# Altium schematic sheet Ultra-Mega-PS-DAC-V1.00.SchDoc: Ultra-Mega-PowerSupply
size A4; Author: Felipe Navarro; SheetNumber: 4; SheetTotal: 5
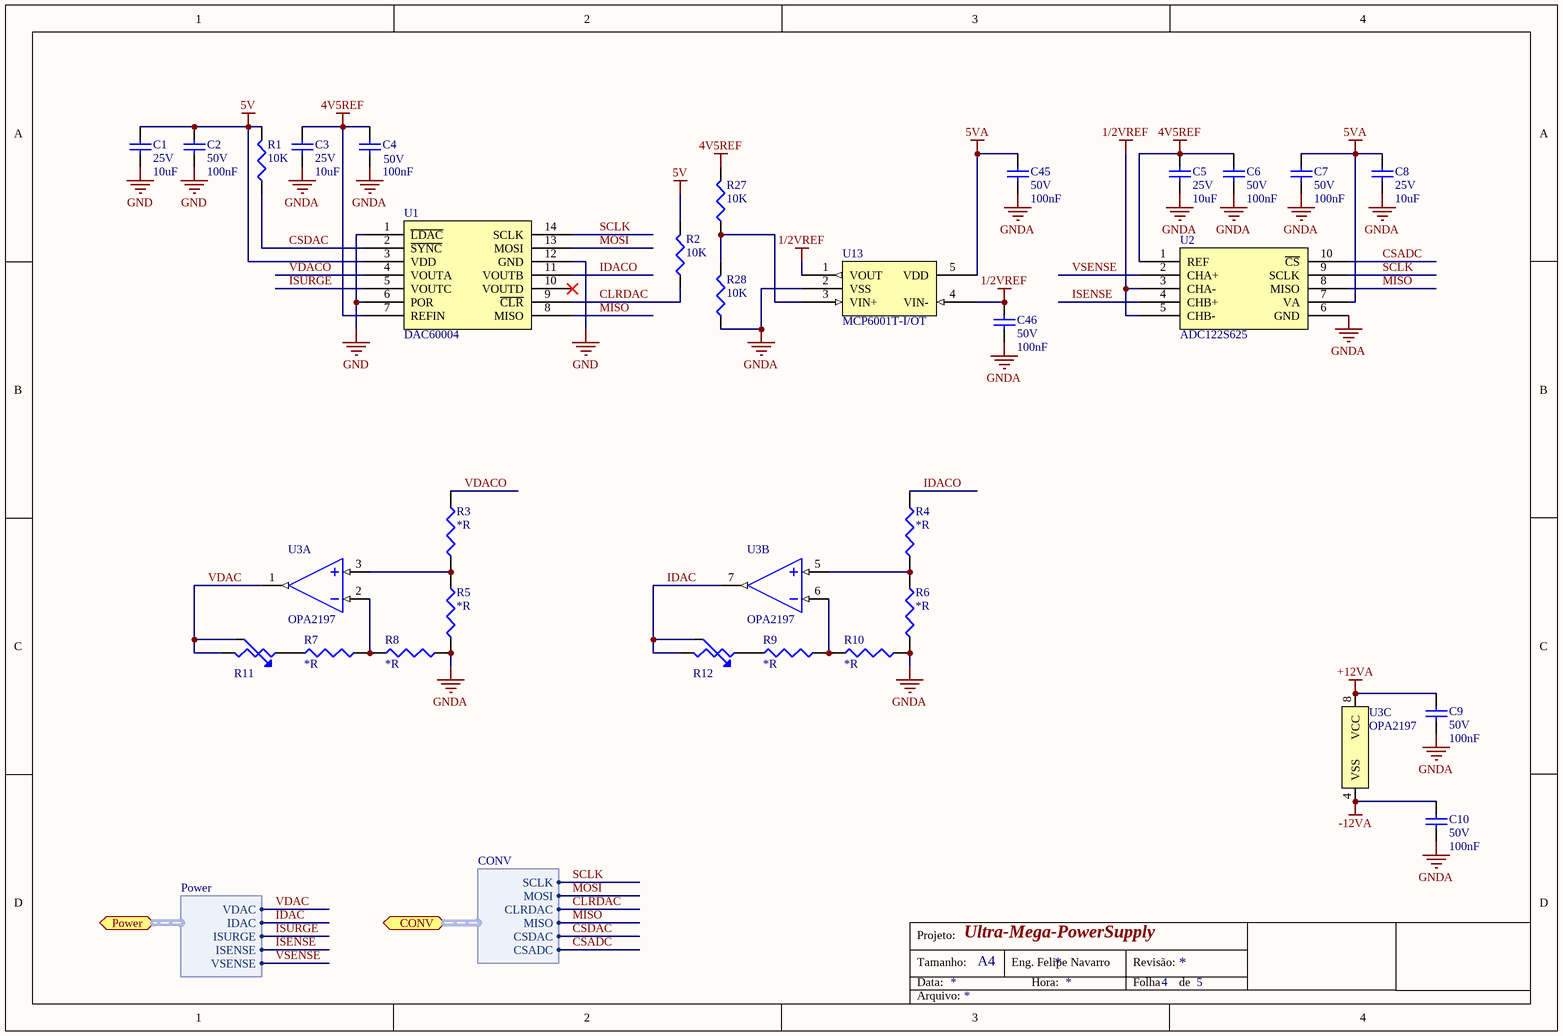
[diagram p0: Ultra-Mega-PS-DAC-V1.00.SchDoc]

## Parts
C1  value 10uF  Tensão: 25V  [CC0805]  (hidden comment: Capacitor Cerâmico)
C2  value 100nF  Tensão: 50V  [CC0603]  (hidden comment: Capacitor Cerâmico)
C3  value 10uF  Tensão: 25V  [CC0805]  (hidden comment: Capacitor Cerâmico)
C4  value 100nF  Tensão: 50V  [CC0603]  (hidden comment: Capacitor Cerâmico)
C5  value 10uF  Tensão: 25V  [CC0805]  (hidden comment: Capacitor Cerâmico)
C6  value 100nF  Tensão: 50V  [CC0603]  (hidden comment: Capacitor Cerâmico)
C7  value 100nF  Tensão: 50V  [CC0603]  (hidden comment: Capacitor Cerâmico)
C8  value 10uF  Tensão: 25V  [CC0805]  (hidden comment: Capacitor Cerâmico)
C9  value 100nF  Tensão: 50V  [CC0603]  (hidden comment: Capacitor Cerâmico)
C10  value 100nF  Tensão: 50V  [CC0603]  (hidden comment: Capacitor Cerâmico)
C45  value 100nF  Tensão: 50V  [CC0603]  (hidden comment: Capacitor Cerâmico)
C46  value 100nF  Tensão: 50V  [CC0603]  (hidden comment: Capacitor Cerâmico)
R1  value 10K  [CC0603]  (hidden comment: Resistor)
R2  value 10K  [CC0603]  (hidden comment: Resistor)
R3  value *R  [CC0603]  (hidden comment: Resistor)
R4  value *R  [CC0603]  (hidden comment: Resistor)
R5  value *R  [CC0603]  (hidden comment: Resistor)
R6  value *R  [CC0603]  (hidden comment: Resistor)
R7  value *R  [CC0603]  (hidden comment: Resistor)
R8  value *R  [CC0603]  (hidden comment: Resistor)
R9  value *R  [CC0603]  (hidden comment: Resistor)
R10  value *R  [CC0603]  (hidden comment: Resistor)
R11  Potenciômetro  [POT]  (value not drawn)
R12  Potenciômetro  [POT]  (value not drawn)
R27  value 10K  [CC0603]  (hidden comment: Resistor)
R28  value 10K  [CC0603]  (hidden comment: Resistor)
U1  DAC60004  [TSSOP-14N]
U2  ADC122S625  [MSOP10]
U3  OPA2197  [SOIC-8N]  (parts A,B,C of 3)
U13  MCP6001T-I/OT  [SOT-23-5N]

## Ports
CONV (harness CONV), Power (harness Power)

## Harnesses
Power: VDAC, IDAC, ISENSE, VSENSE, ISURGE
CONV: SCLK, MOSI, CLRDAC, MISO, CSDAC, CSADC

## Nets
1/2VREF: C46.2 U2.3(CHA-) U2.5(CHB-) U13.1(VOUT) U13.4(VIN-)
4V5REF: C3.2 C4.2 C5.2 C6.2 R27.2 U1.7(REFIN) U2.1(REF)
5V: C1.2 C2.2 R1.2 R2.2 U1.3(VDD)
5VA: C7.2 C8.2 C45.2 U2.7(VA) U13.5(VDD)
+12VA: C9.2 U3.8(VCC)
-12VA: C10.2 U3.4(VSS)
GND: C1.1 C2.1 U1.1(~{LDAC}) U1.6(POR) U1.12(GND)
GNDA: C3.1 C4.1 C5.1 C6.1 C7.1 C8.1 C9.1 C10.1 C45.1 C46.1 R5.1 R6.1 R8.2 R10.2 R28.1 U2.6(GND) U13.2(VSS)
CLRDAC: R2.1 U1.9(~{CLR}) ; port CONV.CLRDAC
CSADC: U2.10(~{CS}) ; port CONV.CSADC
CSDAC: R1.1 U1.2(~{SYNC}) ; port CONV.CSDAC
IDAC: R12.2(TAP) R12.3 U3.7(OUTB) ; port Power.IDAC
IDACO: R4.2 U1.11(VOUTB)
ISENSE: U2.4(CHB+) ; port Power.ISENSE
ISURGE: U1.5(VOUTC) ; port Power.ISURGE
MISO: U1.8(MISO) U2.8(MISO) ; port CONV.MISO
MOSI: U1.13(MOSI) ; port CONV.MOSI
SCLK: U1.14(SCLK) U2.9(SCLK) ; port CONV.SCLK
VDAC: R11.2(TAP) R11.3 U3.1(OUTA) ; port Power.VDAC
VDACO: R3.2 U1.4(VOUTA)
VSENSE: U2.2(CHA+) ; port Power.VSENSE
NetR3_1: R3.1 R5.2 U3.3(INA+)
NetR4_1: R4.1 R6.2 U3.5(INB+)
NetR7_1: R7.1 R11.1
NetR7_2: R7.2 R8.1 U3.2(INA-)
NetR9_1: R9.1 R12.1
NetR9_2: R9.2 R10.1 U3.6(INB-)
NetR27_1: R27.1 R28.2 U13.3(VIN+)

Not connected (* = marked no-connect by the designer): U1 10(VOUTD)*

## Notes on the sheet
- Projeto:
- Tamanho:
- Data:
- A4
- Eng. Felipe Navarro
- Hora:
- Revisão:
- Folha
- de
- Arquivo:

## Library data of the parts
C1 C3 C5 C8 = Cap 10uF 25V 0805 X5R: Capacitor (Semiconductor SIM Model); Chinês: Local; ChinesePrice: 0,02620; Corrente: *A; Potência: *W; Obs:: X5R; Tolerância: ±10%; Supplier 1: Digi-Key; Supplier Part Number 1: 587-2985-1-ND; ComponentLink1Description: Datasheet; ComponentLink1URL: D:\Tecnoclade\Datasheet\!DataMissing.pdf
C2 C4 C6 C7 C9 C10 C45 C46 = Cap 100nF 50V 0603 X7R: Capacitor (Semiconductor SIM Model); Chinês: Local; ChinesePrice: 0,00250; Corrente: *A; Potência: *W; Obs:: X7R; Tolerância: ±10%; Supplier 1: Digi-Key; Supplier Part Number 1: 1276-1000-1-ND; ComponentLink1Description: Datasheet; ComponentLink1URL: D:\Tecnoclade\Datasheet\!DataMissing.pdf
R1 R2 R27 R28 = Res 10K 1% 0603 1/10W: ChinesePrice: 0,00089; Chinês: Local; Corrente: *A; Potência: 1/10W; Tensão: *V; Tolerância: ±1%; Supplier 1: Digi-Key; Supplier Part Number 1: P10.0KHCT-ND; Obs: *; ComponentLink1Description: Datasheet; ComponentLink1URL: D:\Tecnoclade\Datasheet\!DataMissing.pdf
R3-R10 = Res - $Val $% $Footprint $Pot: ChinesePrice: 0,00000; Chinês: ----; Corrente: *A; Potência: 1/10W; Tensão: *V; Tolerância: ±*%; Supplier 1: Digi-Key; Supplier Part Number 1: --Del; Obs:: *; ComponentLink1Description: Datasheet; ComponentLink1URL: D:\Tecnoclade\Datasheet\!DataMissing.pdf
R11 R12 = Res Trim: Trimmer; ChinesePrice: 0,00000; Chinês: ----; Corrente: *A; Potência: *W; Tensão: *V; Tolerância: ±*%; Value: 1K; Supplier 1: Digi-Key; Supplier Part Number 1: --Del; Obs: *; ComponentLink1Description: Datasheet; ComponentLink1URL: D:\Tecnoclade\Datasheet\!DataMissing.pdf
U1 = DAC6004: DACx0004, Quad 16-,14-,12-Bit, 1 LSB INL, Buffered, Voltage-Output Digital-to-Analog  Converters; ChinesePrice: 0,00000; Chinês: ----; Supplier 1: Digi-Key; Supplier Part Number 1: *; Corrente: *; Potência: *; Tensão: *; Value: *; Obs:: *; Tolerância: *; ComponentLink1Description: Datasheet; ComponentLink1URL: D:\Tecnoclade\Datasheet\
U2 = ADC122S625: ADC122S625 Dual 12-Bit, 50 kSPS to 200 kSPS, Simultaneous Sampling A/D Converter; ChinesePrice: 0,00000; Chinês: ----; Supplier 1: Digi-Key; Corrente: *; Potência: *; Tensão: *; Value: *; Obs:: *; Tolerância: *; ComponentLink1Description: Datasheet; ComponentLink1URL: D:\Tecnoclade\Datasheet\
U3 = OPA2197: OPAx197 36-V, Precision, Rail-to-Rail Input/Output, Low Offset Voltage, Operational Amplifiers; Chinês: ----; ChinesePrice: 0,00000; Tensão: 36V; Value: 10MHz; Corrente: 65mA; Potência: *; Supplier 1: Digi-Key; Obs:: Rail-To-Rail; Tolerância: *; ComponentLink1Description: Datasheet; ComponentLink1URL: D:\Tecnoclade\Datasheet\
U13 = MCP6001: 1 MHz, Low-Power Op Amp; ChinesePrice: 0,00000; Chinês: ----; Tensão: 3V75 ~ 6V; Corrente: 500mA; Obs:: +; Potência: *; Value: *; Supplier 1: Digi-Key; Supplier Part Number 1: MCP6001T-I/OTCT-ND; Tolerância: *; ComponentLink1Description: Datasheet; ComponentLink1URL: http://ww1.microchip.com/downloads/en/DeviceDoc/21733j.pdf